# Altium schematic sheet Sheet1.SchDoc
size A1
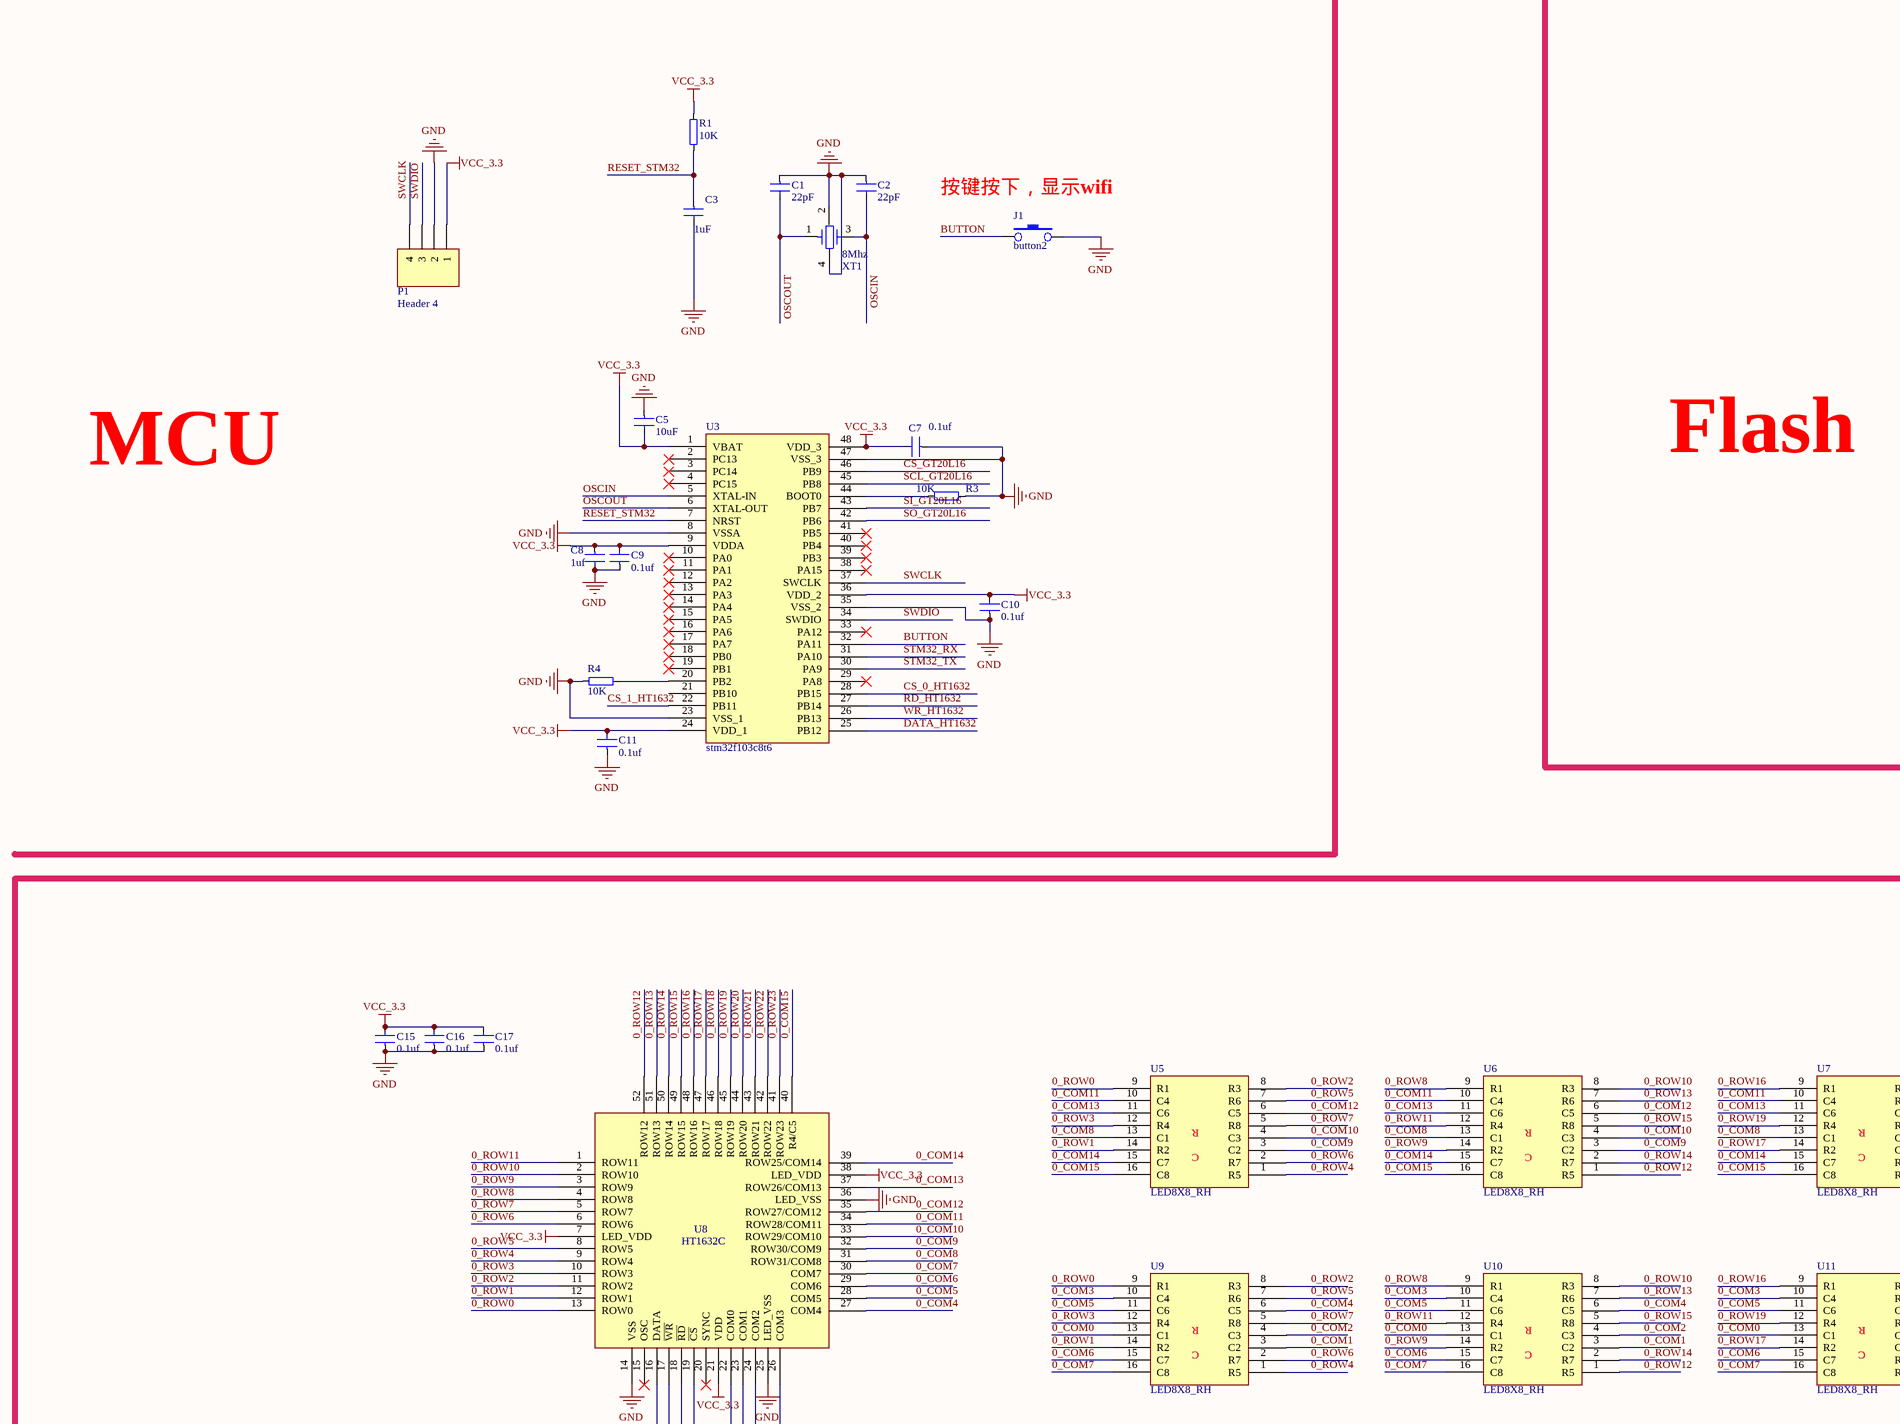
[diagram p0: Sheet1.SchDoc, top left]
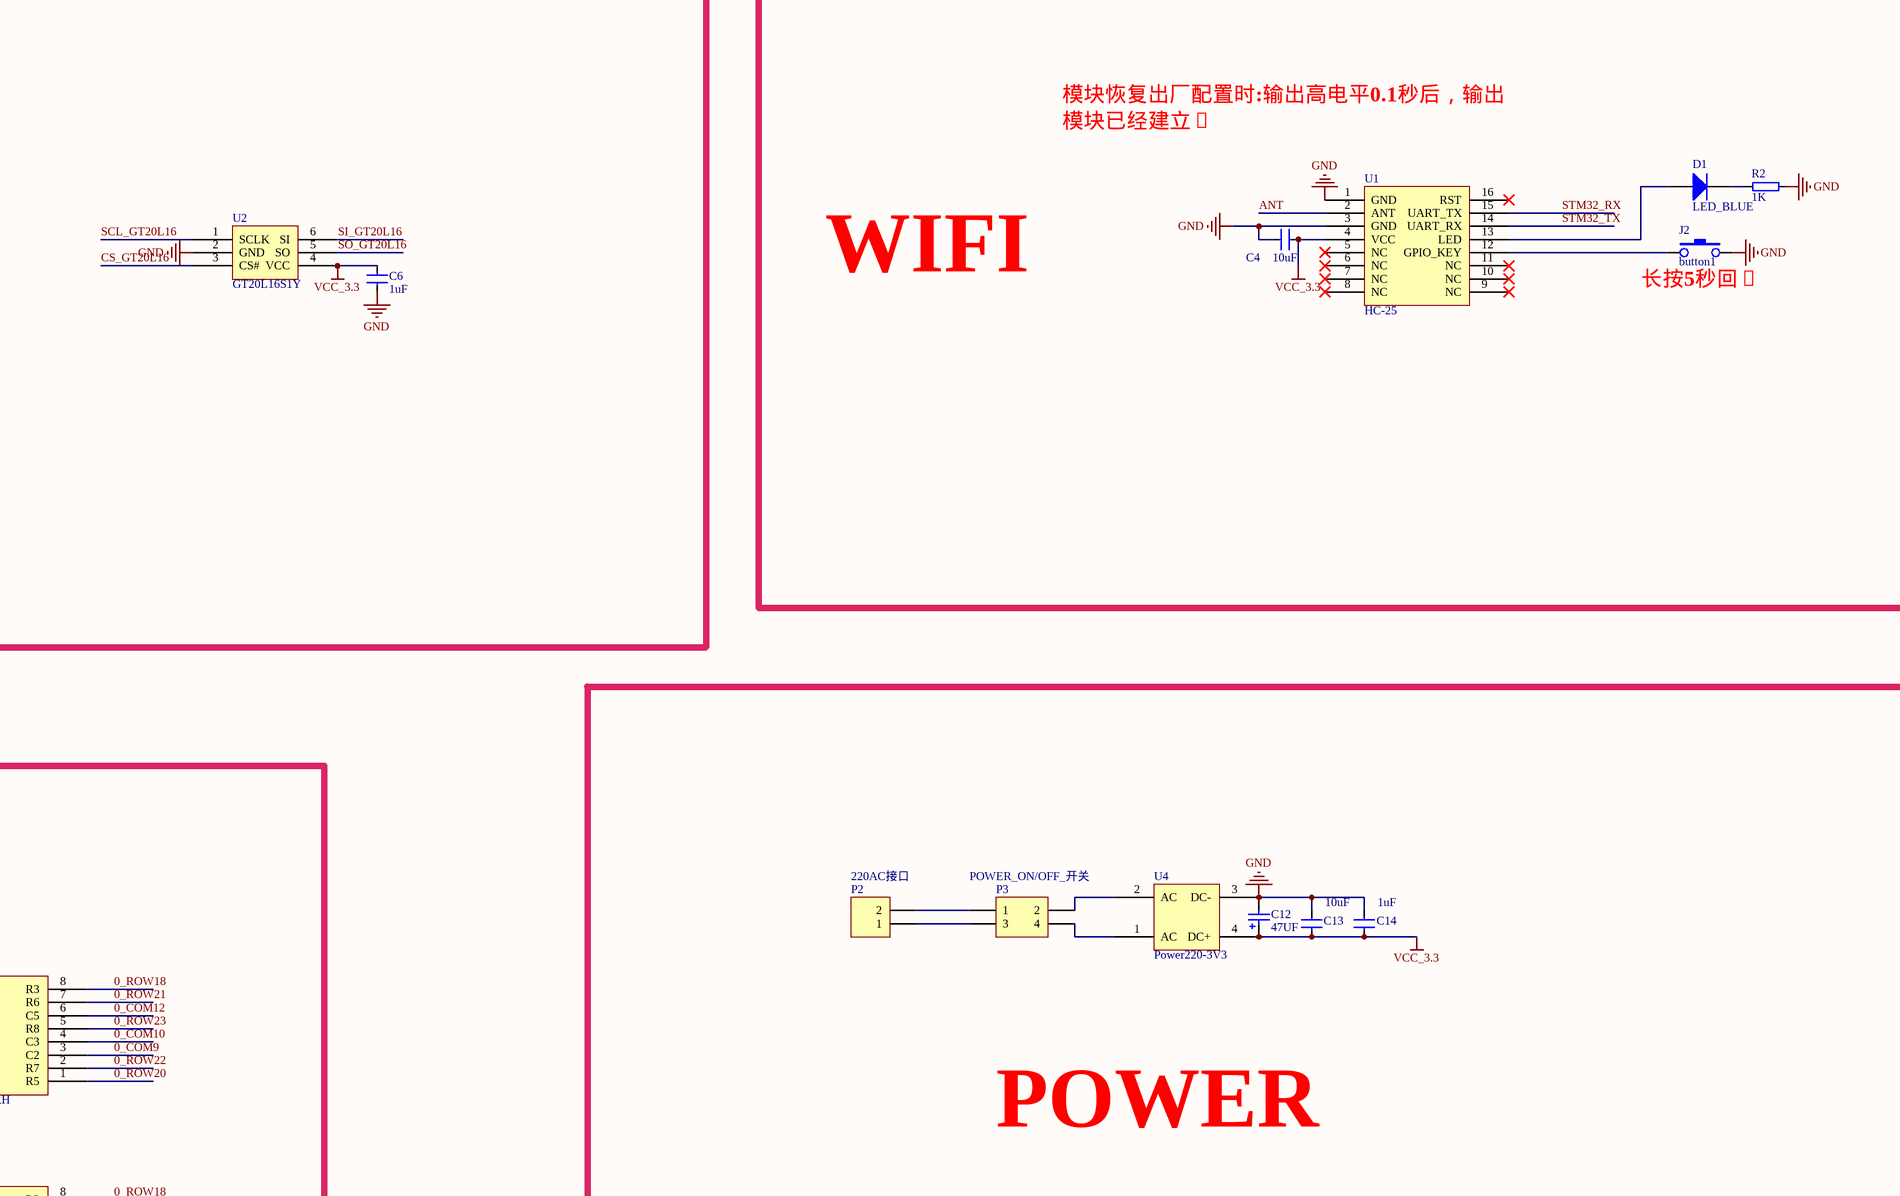
[diagram p1: Sheet1.SchDoc, top right]
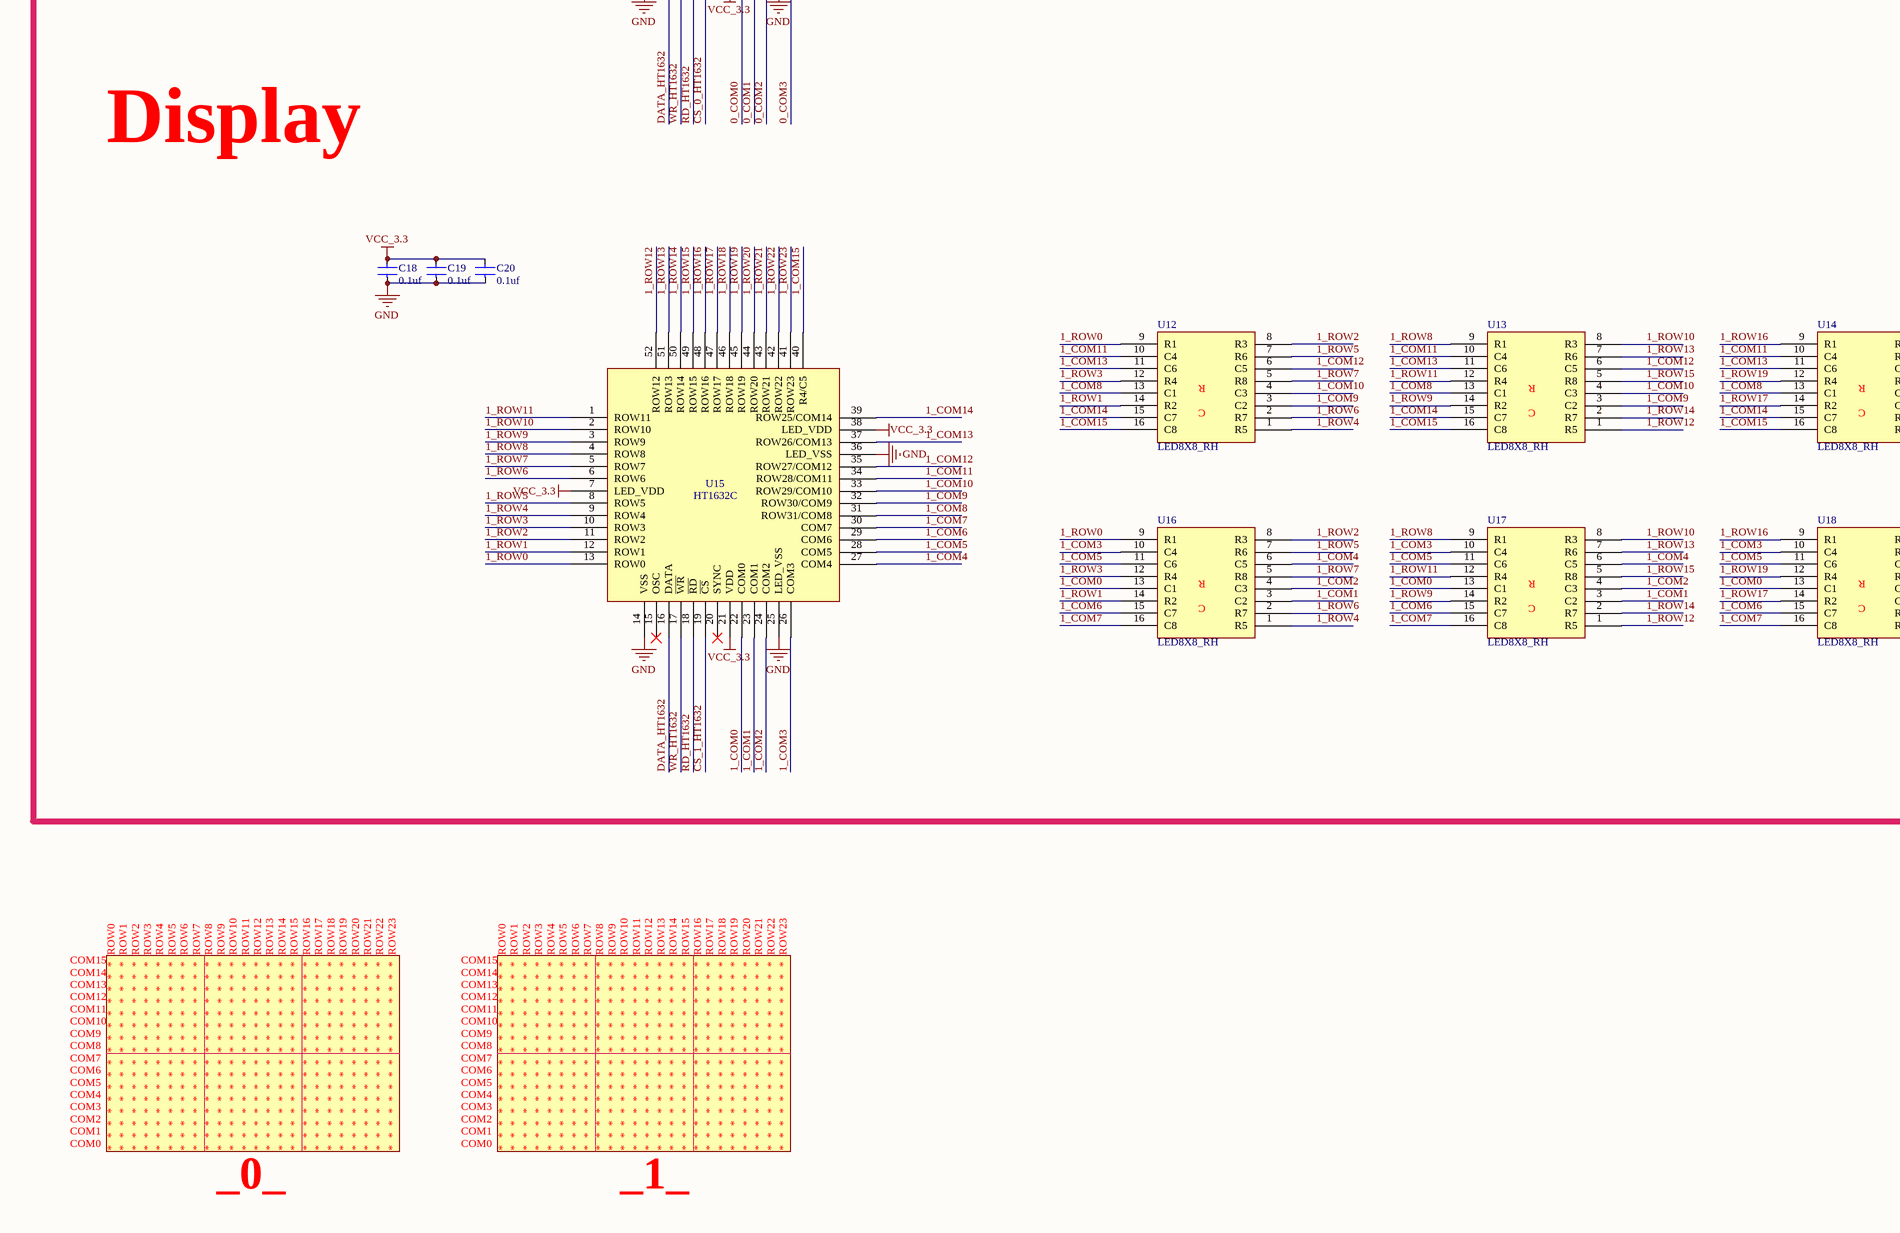
[diagram p2: Sheet1.SchDoc, bottom left]
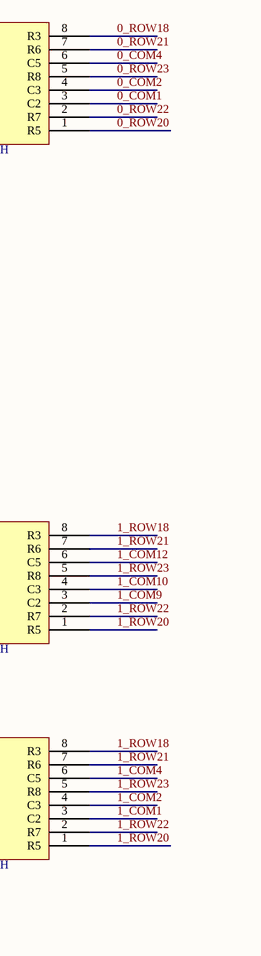
[diagram p3: Sheet1.SchDoc, bottom right]

## Parts
C1  22pF  [0402-A]
C2  22pF  [0402-a]
C3  1uF  [0402-a]
C4  10uF  [0402-a]
C5  10uF  [0402-A]
C6  1uF  [0402-a]
C7  0.1uf  [0402-A]
C8  1uf  [0402-A]
C9  0.1uf  [0402-A]
C10  0.1uf  [0402-A]
C11  0.1uf  [0402-A]
C12  47UF  [POLAR0.8]
C13  10uF  [0402-a]
C14  1uF  [0402-a]
C15  0.1uf  [0402-A]
C16  0.1uf  [0402-A]
C17  0.1uf  [0402-A]
C18  0.1uf  [0402-A]
C19  0.1uf  [0402-A]
C20  0.1uf  [0402-A]
D1  LED_BLUE  [sod523]
J1  button2  [BUTTON]
J2  button1  [BUTTON]
P1  Header 4  [HDR1X4]
P2  220AC接口  [HDR1X2]
P3  POWER_ON/OFF_开关  [HDR2X2]
R1  10K  [0402-A]
R2  1K  [0402-A]
R3  10K  [0402-A]
R4  10K  [0402-A]
U1  HC-25
U2  GT20L16S1Y
U3  stm32f103c8t6
U4  Power220-3V3
U5  LED8X8_RH
U6  LED8X8_RH
U7  LED8X8_RH
U8  HT1632C
U9  LED8X8_RH
U10  LED8X8_RH
U11  LED8X8_RH
U12  LED8X8_RH
U13  LED8X8_RH
U14  LED8X8_RH
U15  HT1632C
U16  LED8X8_RH
U17  LED8X8_RH
U18  LED8X8_RH
XT1  8Mhz  [SMD3225]

## Blocks framed on the sheet
Flash: C6 U2
WIFI: C4 D1 J2 R2 U1
POWER: C12-C14 P2 P3 U4
Display: C15-C20 U5-U18

## Nets
GND: C1.1 C2.1 C3.2 C4.2 C5.1 C6.1 C7.1 C8.2 C9.1 C10.1 C11.1 C12.2 C13.2 C14.2 C15.1 C16.1 C17.1 C18.1 C19.1 C20.1 J1.1 J2.1 P1.2 R2.1 R3.1 R4.2 U1.1(GND) U1.3(GND) U2.2(GND) U3.8(VSSA) U3.23(VSS_1) U3.35(VSS_2) U3.47(VSS_3) U4.3(DC-) U8.14(VSS) U8.25(LED_VSS) U8.36(LED_VSS) U15.14(VSS) U15.25(LED_VSS) U15.36(LED_VSS) XT1.2 XT1.4
VCC_3.3: C4.1 C5.2 C6.2 C7.2 C8.1 C9.2 C10.2 C11.2 C12.1 C13.1 C14.1 C15.2 C16.2 C17.2 C18.2 C19.2 C20.2 P1.1 R1.2 U1.4(VCC) U2.4(VCC) U3.1(VBAT) U3.9(VDDA) U3.24(VDD_1) U3.36(VDD_2) U3.48(VDD_3) U4.4(DC+) U8.7(LED_VDD) U8.21(VDD) U8.38(LED_VDD) U15.7(LED_VDD) U15.21(VDD) U15.38(LED_VDD)
0_COM0: U8.22(COM0) U9.13(C1) U10.13(C1) U11.13(C1)
0_COM1: U8.23(COM1) U9.3(C2) U10.3(C2) U11.3(C2)
0_COM2: U8.24(COM2) U9.4(C3) U10.4(C3) U11.4(C3)
0_COM3: U8.26(COM3) U9.10(C4) U10.10(C4) U11.10(C4)
0_COM4: U8.27(COM4) U9.6(C5) U10.6(C5) U11.6(C5)
0_COM5: U8.28(COM5) U9.11(C6) U10.11(C6) U11.11(C6)
0_COM6: U8.29(COM6) U9.15(C7) U10.15(C7) U11.15(C7)
0_COM7: U8.30(COM7) U9.16(C8) U10.16(C8) U11.16(C8)
0_COM8: U5.13(C1) U6.13(C1) U7.13(C1) U8.31(ROW31/COM8)
0_COM9: U5.3(C2) U6.3(C2) U7.3(C2) U8.32(ROW30/COM9)
0_COM10: U5.4(C3) U6.4(C3) U7.4(C3) U8.33(ROW29/COM10)
0_COM11: U5.10(C4) U6.10(C4) U7.10(C4) U8.34(ROW28/COM11)
0_COM12: U5.6(C5) U6.6(C5) U7.6(C5) U8.35(ROW27/COM12)
0_COM13: U5.11(C6) U6.11(C6) U7.11(C6) U8.37(ROW26/COM13)
0_COM14: U5.15(C7) U6.15(C7) U7.15(C7) U8.39(ROW25/COM14)
0_COM15: U5.16(C8) U6.16(C8) U7.16(C8) U8.40(R4/C5)
0_ROW0: U5.9(R1) U8.13(ROW0) U9.9(R1)
0_ROW1: U5.14(R2) U8.12(ROW1) U9.14(R2)
0_ROW2: U5.8(R3) U8.11(ROW2) U9.8(R3)
0_ROW3: U5.12(R4) U8.10(ROW3) U9.12(R4)
0_ROW4: U5.1(R5) U8.9(ROW4) U9.1(R5)
0_ROW5: U5.7(R6) U8.8(ROW5) U9.7(R6)
0_ROW6: U5.2(R7) U8.6(ROW6) U9.2(R7)
0_ROW7: U5.5(R8) U8.5(ROW7) U9.5(R8)
0_ROW8: U6.9(R1) U8.4(ROW8) U10.9(R1)
0_ROW9: U6.14(R2) U8.3(ROW9) U10.14(R2)
0_ROW10: U6.8(R3) U8.2(ROW10) U10.8(R3)
0_ROW11: U6.12(R4) U8.1(ROW11) U10.12(R4)
0_ROW12: U6.1(R5) U8.52(ROW12) U10.1(R5)
0_ROW13: U6.7(R6) U8.51(ROW13) U10.7(R6)
0_ROW14: U6.2(R7) U8.50(ROW14) U10.2(R7)
0_ROW15: U6.5(R8) U8.49(ROW15) U10.5(R8)
0_ROW16: U7.9(R1) U8.48(ROW16) U11.9(R1)
0_ROW17: U7.14(R2) U8.47(ROW17) U11.14(R2)
0_ROW18: U7.8(R3) U8.46(ROW18) U11.8(R3)
0_ROW19: U7.12(R4) U8.45(ROW19) U11.12(R4)
0_ROW20: U7.1(R5) U8.44(ROW20) U11.1(R5)
0_ROW21: U7.7(R6) U8.43(ROW21) U11.7(R6)
0_ROW22: U7.2(R7) U8.42(ROW22) U11.2(R7)
0_ROW23: U7.5(R8) U8.41(ROW23) U11.5(R8)
1_COM0: U15.22(COM0) U16.13(C1) U17.13(C1) U18.13(C1)
1_COM1: U15.23(COM1) U16.3(C2) U17.3(C2) U18.3(C2)
1_COM2: U15.24(COM2) U16.4(C3) U17.4(C3) U18.4(C3)
1_COM3: U15.26(COM3) U16.10(C4) U17.10(C4) U18.10(C4)
1_COM4: U15.27(COM4) U16.6(C5) U17.6(C5) U18.6(C5)
1_COM5: U15.28(COM5) U16.11(C6) U17.11(C6) U18.11(C6)
1_COM6: U15.29(COM6) U16.15(C7) U17.15(C7) U18.15(C7)
1_COM7: U15.30(COM7) U16.16(C8) U17.16(C8) U18.16(C8)
1_COM8: U12.13(C1) U13.13(C1) U14.13(C1) U15.31(ROW31/COM8)
1_COM9: U12.3(C2) U13.3(C2) U14.3(C2) U15.32(ROW30/COM9)
1_COM10: U12.4(C3) U13.4(C3) U14.4(C3) U15.33(ROW29/COM10)
1_COM11: U12.10(C4) U13.10(C4) U14.10(C4) U15.34(ROW28/COM11)
1_COM12: U12.6(C5) U13.6(C5) U14.6(C5) U15.35(ROW27/COM12)
1_COM13: U12.11(C6) U13.11(C6) U14.11(C6) U15.37(ROW26/COM13)
1_COM14: U12.15(C7) U13.15(C7) U14.15(C7) U15.39(ROW25/COM14)
1_COM15: U12.16(C8) U13.16(C8) U14.16(C8) U15.40(R4/C5)
1_ROW0: U12.9(R1) U15.13(ROW0) U16.9(R1)
1_ROW1: U12.14(R2) U15.12(ROW1) U16.14(R2)
1_ROW2: U12.8(R3) U15.11(ROW2) U16.8(R3)
1_ROW3: U12.12(R4) U15.10(ROW3) U16.12(R4)
1_ROW4: U12.1(R5) U15.9(ROW4) U16.1(R5)
1_ROW5: U12.7(R6) U15.8(ROW5) U16.7(R6)
1_ROW6: U12.2(R7) U15.6(ROW6) U16.2(R7)
1_ROW7: U12.5(R8) U15.5(ROW7) U16.5(R8)
1_ROW8: U13.9(R1) U15.4(ROW8) U17.9(R1)
1_ROW9: U13.14(R2) U15.3(ROW9) U17.14(R2)
1_ROW10: U13.8(R3) U15.2(ROW10) U17.8(R3)
1_ROW11: U13.12(R4) U15.1(ROW11) U17.12(R4)
1_ROW12: U13.1(R5) U15.52(ROW12) U17.1(R5)
1_ROW13: U13.7(R6) U15.51(ROW13) U17.7(R6)
1_ROW14: U13.2(R7) U15.50(ROW14) U17.2(R7)
1_ROW15: U13.5(R8) U15.49(ROW15) U17.5(R8)
1_ROW16: U14.9(R1) U15.48(ROW16) U18.9(R1)
1_ROW17: U14.14(R2) U15.47(ROW17) U18.14(R2)
1_ROW18: U14.8(R3) U15.46(ROW18) U18.8(R3)
1_ROW19: U14.12(R4) U15.45(ROW19) U18.12(R4)
1_ROW20: U14.1(R5) U15.44(ROW20) U18.1(R5)
1_ROW21: U14.7(R6) U15.43(ROW21) U18.7(R6)
1_ROW22: U14.2(R7) U15.42(ROW22) U18.2(R7)
1_ROW23: U14.5(R8) U15.41(ROW23) U18.5(R8)
ANT: U1.2(ANT)
BUTTON: J1.2 U3.32(PA11)
CS_0_HT1632: U3.28(PB15) U8.19(~{CS})
CS_1_HT1632: U3.22(PB11) U15.19(~{CS})
CS_GT20L16: U2.3(CS#) U3.46(PB9)
DATA_HT1632: U3.25(PB12) U8.16(DATA) U15.16(DATA)
OSCIN: C2.2 U3.5(XTAL-IN) XT1.3
OSCOUT: C1.2 U3.6(XTAL-OUT) XT1.1
RD_HT1632: U3.27(PB14) U8.18(~{RD}) U15.18(~{RD})
RESET_STM32: C3.1 R1.1 U3.7(NRST)
SCL_GT20L16: U2.1(SCLK) U3.45(PB8)
SI_GT20L16: U2.6(SI) U3.43(PB7)
SO_GT20L16: U2.5(SO) U3.42(PB6)
STM32_RX: U1.15(UART_TX) U3.31(PA10)
STM32_TX: U1.14(UART_RX) U3.30(PA9)
SWCLK: P1.4 U3.37(SWCLK)
SWDIO: P1.3 U3.34(SWDIO)
WR_HT1632: U3.26(PB13) U8.17(~{WR}) U15.17(~{WR})
NetD1_1: D1.1(A) U1.13(LED)
NetD1_2: D1.2(K) R2.2
NetJ2_2: J2.2 U1.12(GPIO_KEY)
NetP2_1: P2.1 P3.3
NetP2_2: P2.2 P3.1
NetP3_2: P3.2 U4.2(AC)
NetP3_4: P3.4 U4.1(AC)
NetR3_2: R3.2 U3.44(BOOT0)
NetR4_1: R4.1 U3.20(PB2)

Not connected (* = marked no-connect by the designer): U1 5(NC)* 6(NC)* 7(NC)* 8(NC)* 9(NC)* 10(NC)* 11(NC)* 16(RST)*; U3 2(PC13)* 3(PC14)* 4(PC15)* 10(PA0)* 11(PA1)* 12(PA2)* 13(PA3)* 14(PA4)* 15(PA5)* 16(PA6)* 17(PA7)* 18(PB0)* 19(PB1)* 21(PB10) 29(PA8)* 33(PA12)* 38(PA15)* 39(PB3)* 40(PB4)* 41(PB5)*; U8 15(OSC)* 20(SYNC)*; U15 15(OSC)* 20(SYNC)*

## Notes on the sheet
- (near J1) 按键按下，显示wifi
- 模块恢复出厂配置时:输出高电平0.1秒后，输出
- 模块已经建立�
- MCU
- (near J2) 长按5秒回�
- COM13
- COM14
- COM15
- ROW0
- *
- ROW1
- ROW2
- ROW3
- ROW4
- ROW5
- ROW6
- ROW7
- ROW8
- ROW9
- ROW10
- ROW11
- ROW12
- ROW13
- ROW14
- ROW15
- ROW16
- ROW17
- ROW18
- ROW19
- ROW20
- ROW21
- ROW22
- ROW23
- COM8
- COM9
- COM10
- COM11
- COM12
- COM3
- COM4
- COM5
- COM6
- COM7
- COM0
- COM1
- COM2
- _0_
- _1_
- (in symbol LED8X8_RH) R; C

## Library data of the parts
C1-C11 C13-C20 = CAP-0.: SMD-CAP
C12 = Cap Pol2: Polarized Capacitor (Axial); Published: 8-Jun-2000; LatestRevisionDate: 17-Jul-2002; LatestRevisionNote: Re-released for DXP Platform.; PackageReference: POLAR0.8; Publisher: Altium Limited; PackageDescription: Polarized Capacitor; 2 Leads; Value: 47UF
D1 = Diode: Default Diode; Published: 8-Jun-2000; LatestRevisionDate: 17-Jul-2002; LatestRevisionNote: Re-released for DXP Platform.; PackageDocument: Sep-1996; PackageReference: SMC; Publisher: Altium Limited; Code_JEDEC: DO-214-AB
J1 J2 = KEY
P1 = Header 4: Header, 4-Pin; LatestRevisionDate: 17-Jul-2002; LatestRevisionNote: Re-released for DXP Platform.; Publisher: Altium Limited
P2 = Header 2: Header, 2-Pin; LatestRevisionDate: 17-Jul-2002; LatestRevisionNote: Re-released for DXP Platform.; Publisher: Altium Limited
P3 = Header 2X2: Header, 2-Pin, Dual row; LatestRevisionDate: 17-Jul-2002; LatestRevisionNote: Re-released for DXP Platform.; Publisher: Altium Limited
R1-R4 = R-10K: resistor
XT1 = XT: 晶振